# EAGLE design display (EAGLE 5.11)
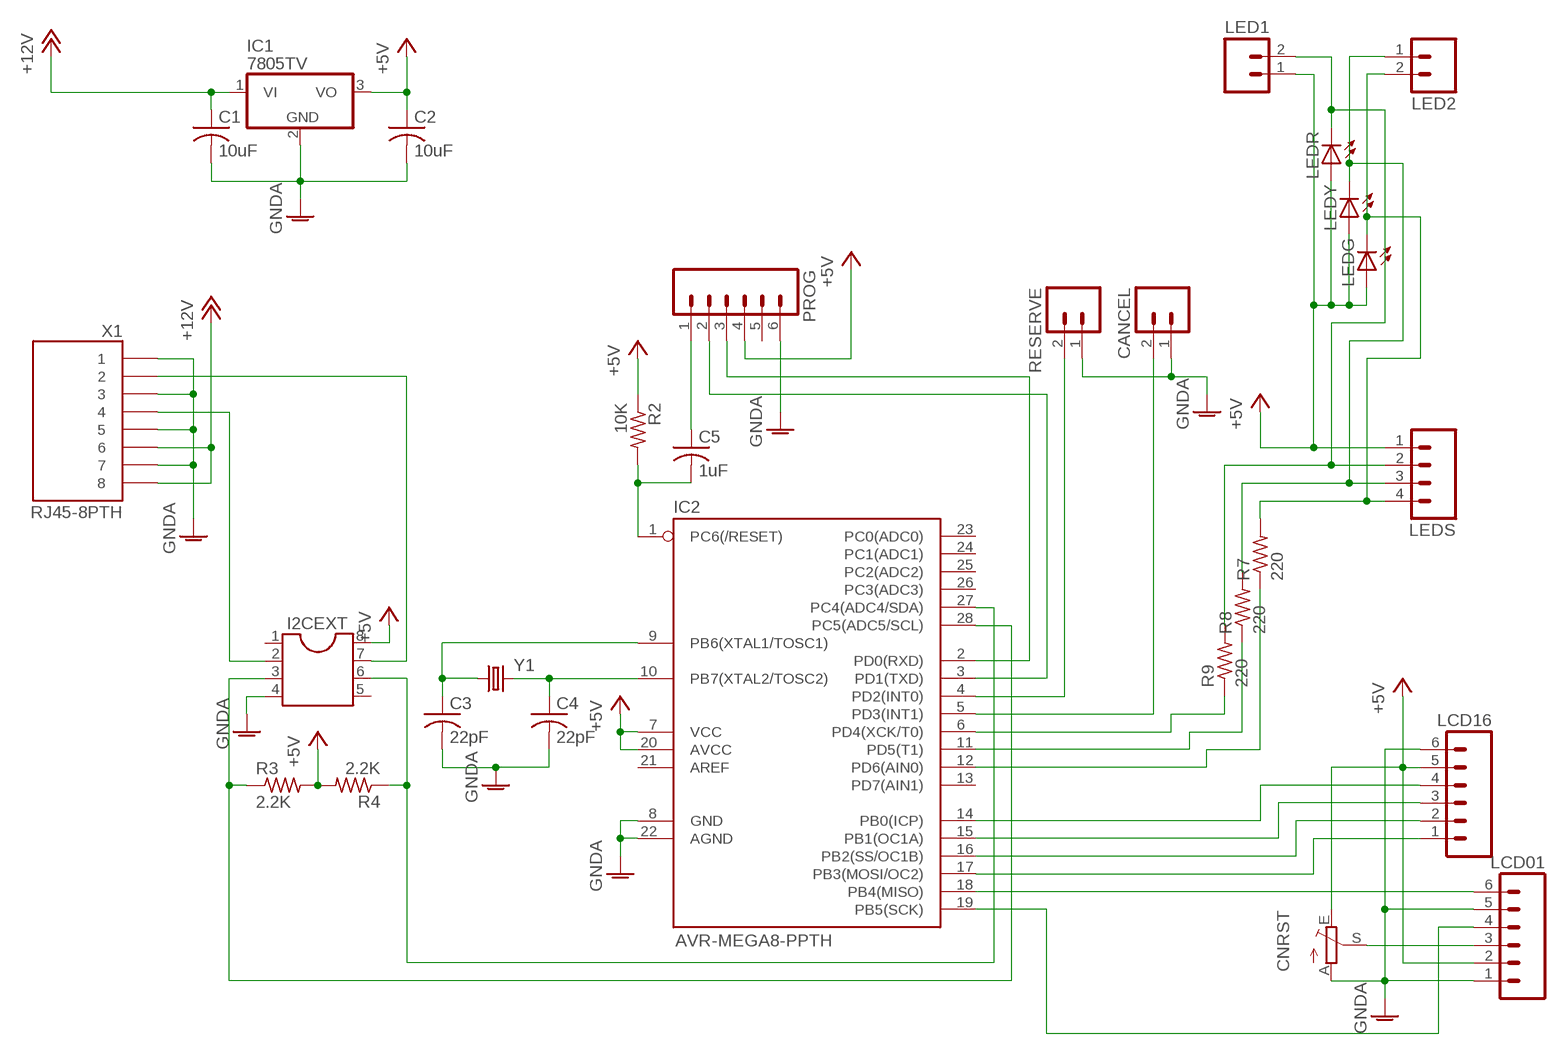
[diagram p0: schematic, sheet 1]

## Parts
C1  10uF  C-US025-024X044  [C025-024X044]
C2  10uF  C-US025-024X044  [C025-024X044]
C3  22pF  C-US025-024X044  [C025-024X044]
C4  22pF  C-US025-024X044  [C025-024X044]
C5  1uF  C-US025-024X044  [C025-024X044]
CANCEL  M02POLAR_LOCK  [MOLEX-1X2_LOCK]
CNRST  TRIM_EU-B25U  [B25U]
I2CEXT  DIL8  [DIL08]
IC1  7805TV  [TO220V]
IC2  AVR-MEGA8-PPTH  [DIL28-3]
LCD01  M06SIP_LOCK  [1X06-SIP_LOCK]
LCD16  M06SIP_LOCK  [1X06-SIP_LOCK]
LED1  M02LOCK  [1X02_LOCK]
LED2  M02LOCK  [1X02_LOCK]
LEDG  LED10MM  [LED10MM]
LEDR  LED10MM  [LED10MM]
LEDS  M04LOCK  [1X04_LOCK]
LEDY  LED10MM  [LED10MM]
PROG  M06LOCK  [1X06_LOCK]
R2  10K  R-US_0207/2V  [0207/2V]
R3  2.2K  R-US_0207/2V  [0207/2V]
R4  2.2K  R-US_0207/2V  [0207/2V]
R7  220  R-US_0207/2V  [0207/2V]
R8  220  R-US_0207/2V  [0207/2V]
R9  220  R-US_0207/2V  [0207/2V]
RESERVE  M02POLAR_LOCK  [MOLEX-1X2_LOCK]
X1  RJ45-8PTH  [RJ45-8]
Y1  CRYSTALHC49US  [HC49US]

## Nets
+5V: C2.1 CNRST.E I2CEXT.8 IC1.3(VO) IC2.7(VCC) IC2.20(AVCC) LCD01.2 LCD16.5 LED1.1 LEDG.A LEDR.A LEDS.1 LEDY.A PROG.4 R2.1 R3.2 R4.2
+12V: C1.1 IC1.1(VI) X1.6 X1.8
GNDA: C1.2 C2.2 C3.2 C4.2 CANCEL.1 CNRST.A I2CEXT.4 IC1.2(GND) IC2.8(GND) IC2.22(AGND) LCD01.1 LCD01.5 LCD16.6 PROG.6 RESERVE.1 X1.1 X1.3 X1.5 X1.7
LSDA: I2CEXT.2 X1.4
LSDC: I2CEXT.7 X1.2
N$1: C3.1 IC2.9(PB6(XTAL1/TOSC1)) Y1.1
N$2: C4.1 IC2.10(PB7(XTAL2/TOSC2)) Y1.2
N$3: I2CEXT.3 IC2.28(PC5(ADC5/SCL)) R3.1
N$4: C5.1 PROG.1
N$6: C5.2 IC2.1(PC6(/RESET)) R2.2
N$7: IC2.4(PD2(INT0)) RESERVE.2
N$8: CANCEL.2 IC2.5(PD3(INT1))
N$9: IC2.6(PD4(XCK/T0)) R9.1
N$10: I2CEXT.6 IC2.27(PC4(ADC4/SDA)) R4.1
N$11: IC2.11(PD5(T1)) R8.1
N$12: IC2.12(PD6(AIN0)) R7.1
N$13: LED1.2 LEDR.C LEDS.2 R9.2
N$14: IC2.19(PB5(SCK)) LCD01.4
N$17: CNRST.S LCD01.3
N$20: IC2.18(PB4(MISO)) LCD01.6
N$21: IC2.17(PB3(MOSI/OC2)) LCD16.1
N$22: IC2.3(PD1(TXD)) PROG.2
N$23: IC2.2(PD0(RXD)) PROG.3
N$24: IC2.16(PB2(SS/OC1B)) LCD16.2
N$25: IC2.15(PB1(OC1A)) LCD16.3
N$26: IC2.14(PB0(ICP)) LCD16.4
N$27: LED2.1 LEDS.3 LEDY.C R8.2
N$28: LED2.2 LEDG.C LEDS.4 R7.2
Unconnected: I2CEXT.1 I2CEXT.5 IC2.13(PD7(AIN1)) IC2.21(AREF) IC2.23(PC0(ADC0)) IC2.24(PC1(ADC1)) IC2.25(PC2(ADC2)) IC2.26(PC3(ADC3)) PROG.5

## Library data of the parts
C1-C5 = rcl:C-US: CAPACITOR, American symbol
CANCEL LED1 LED2 RESERVE = SparkFun:M02: Header 2 Standard 2-pin 0.1" header. Use with straight break away headers (SKU : PRT-00116), right angle break away headers (PRT-00553), swiss pins (PRT-00743), machine pins (PRT-00117), and female headers (PRT-00115). Molex polarized connector foot print use with SKU : PRT-08233 with associated crimp pins and housings.
CNRST = pot:TRIM_EU-: POTENTIOMETER
I2CEXT = ic-package:DIL8: Dual In Line / Socket
IC1 = linear:78*: Positive VOLTAGE REGULATOR Source: http://cache.national.com/ds/LM/LM78L05.pdf http://www.fairchildsemi.com/ds/LM/LM7805.pdf
IC2 = SparkFun:AVR-MEGA8-P: MICROCONTROLLER 8 Kbytes FLASH 1 kbytes SRAM 512 bytes EEPROM USART 4-channel 10 bit ADC 2-channel 8 bit ADC
LCD01 LCD16 PROG = SparkFun:M06: Header 6 Standard 6-pin 0.1" header. Use with straight break away headers (SKU : PRT-00116), right angle break away headers (PRT-00553), swiss pins (PRT-00743), machine pins (PRT-00117), and female headers (PRT-00115). Molex polarized connector foot print use with SKU : PRT-08094 with associated crimp pins and housings. NOTES ON THE VARIANTS LOCK and LOCK_LONGPADS... This footprint was designed to help hold the alignment of a through-hole component (i.e. 6-pin header) while soldering it into place. You may notice that each hole has been shifted either up or down by 0.005 of an inch from it's more standard position (which is a perfectly straight line). This slight alteration caused the pins (the squares in the middle) to touch the edges of the holes. Because they are alternating, it causes a "brace" to hold the component in place. 0.005 has proven to be the perfect amount of "off-center" position when using our standard breakaway headers. Although looks a little odd when you look at the bare footprint, once you have a header in there, the alteration is very hard to notice. Also, if you push a header all the way into place, it is covered up entirely on the bottom side. This idea of altering the position of holes to aid alignment will be further integrated into the Sparkfun Library for other footprints. It can help hold any component with 3 or more connection pins.
LEDG LEDR LEDY = SparkFun:LED: LEDs Standard schematic elements and footprints for 5mm, 3mm, 1206, and 0603 sized LEDs. 5mm - Spark Fun Electronics SKU : COM-00529 (and others)
LEDS = SparkFun:M04: Header 4 Standard 4-pin 0.1" header. Use with straight break away headers (SKU : PRT-00116), right angle break away headers (PRT-00553), swiss pins (PRT-00743), machine pins (PRT-00117), and female headers (PRT-00115). Molex polarized connector foot print use with SKU : PRT-08231 with associated crimp pins and housings. 1MM SMD Version SKU: PRT-10208
R2-R4 R7-R9 = resistor:R-US_: RESISTOR, American symbol
X1 = SparkFun:RJ45-8: RJ45 Jack Simple RJ45, 8-pin connection - connector for common Cat5, Cat5e, and Cat6 Ethernet cables. Footprint not yet proven in production. Connector sku is PRT-00643; Breakout PCB sku is BOB-00716.
Y1 = SparkFun:CRYSTAL: Crystals Various standard crystals. Proven footprints. Spark Fun Electronics SKU : COM-00534

## Board
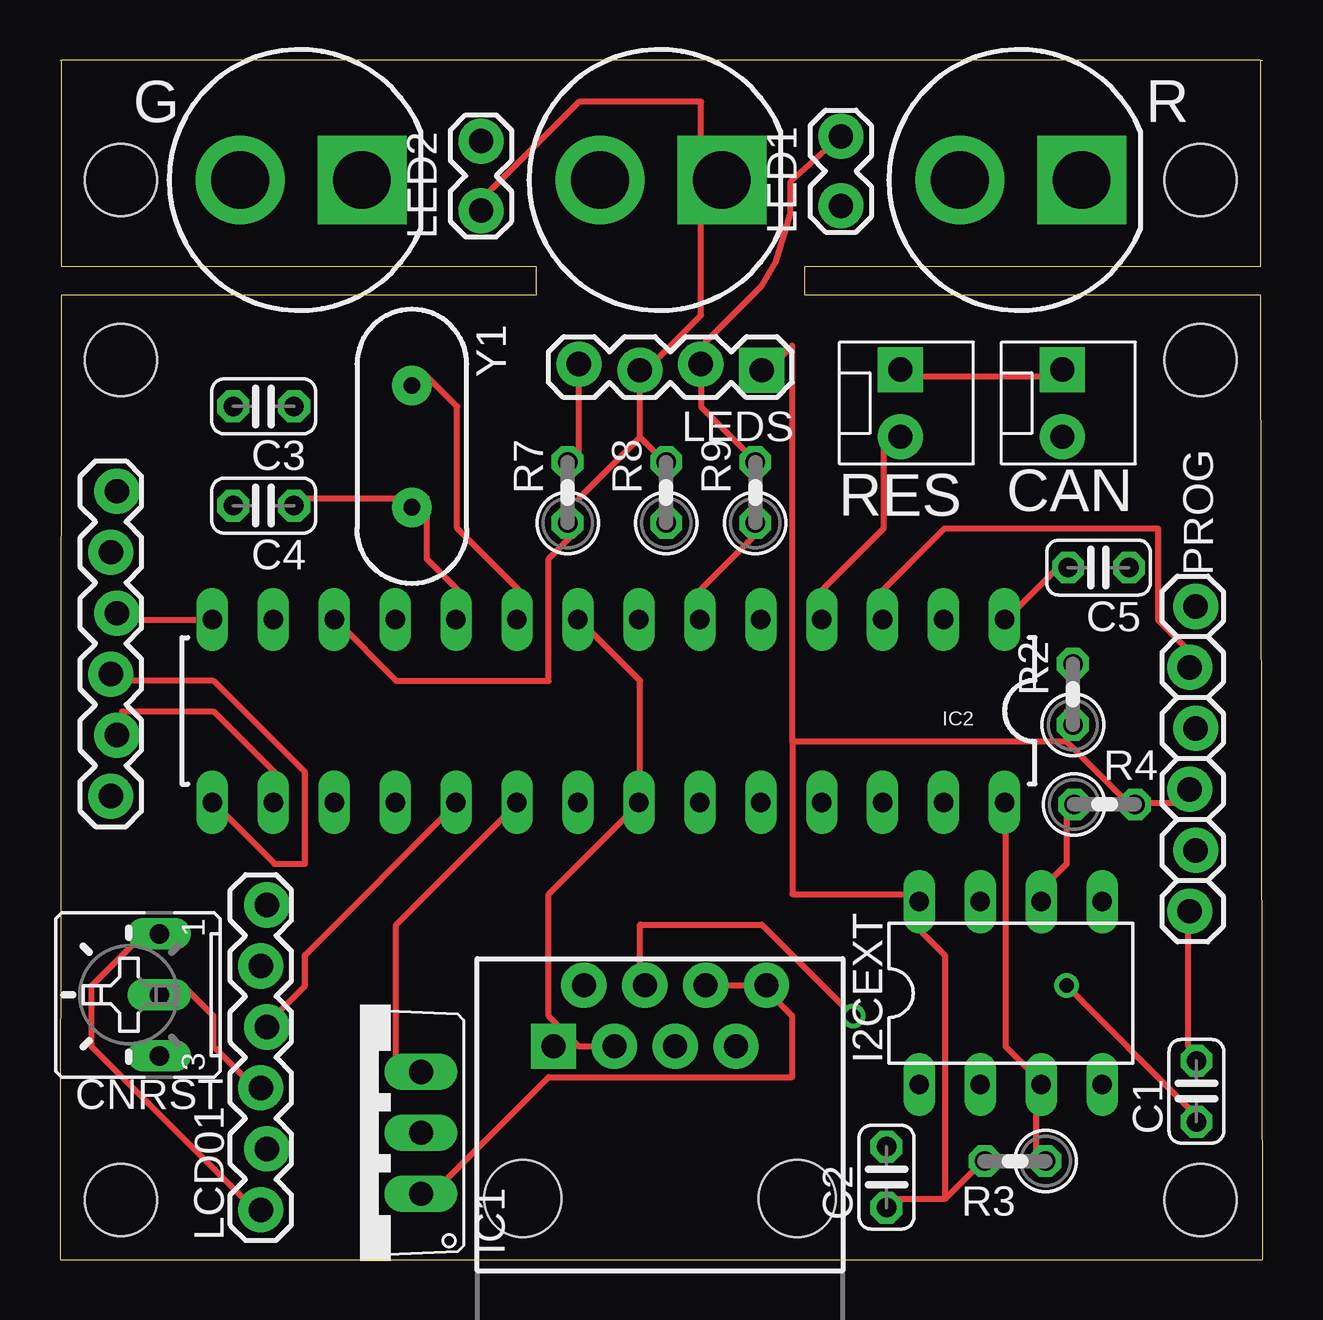
[diagram p1: board, top side]
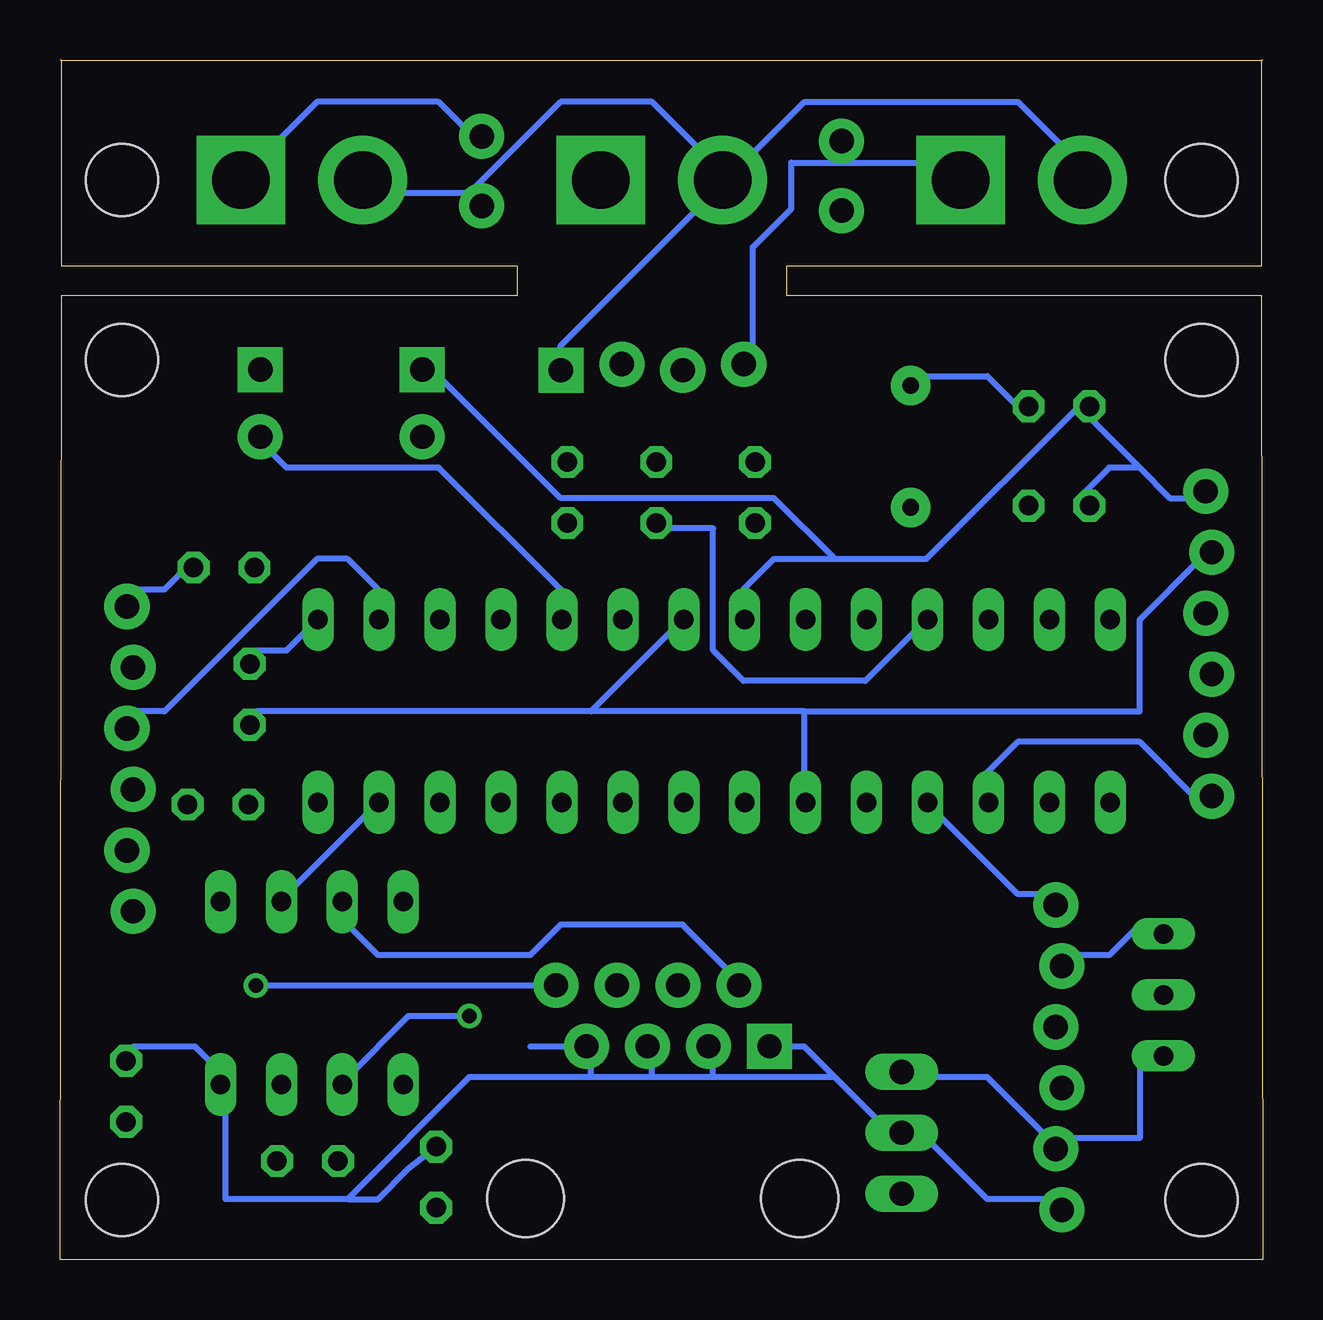
[diagram p2: board, bottom side, seen from below]

Size 50.13 x 49.98 mm. Coordinates in mm from the lower left corner, seen from the top.
Outline: 50.05,49.98 50.05,41.38 31.05,41.38 31.05,40.18 50.05,40.18 50.05,39.98 50.13,0 0,0 0.05,40.18 19.85,40.18 19.85,41.38 0.05,41.38 0.05,49.98
Outline: 50.05,49.98 50.13,49.98
Outline: 50.05,49.98 0.05,49.98
Outline: 0,49.98 0.05,49.98
Copper layers (1*16): Top 0.035mm / dielectric 1.5mm / Bottom 0.035mm
Design rules "default": minimum track width 10mil, minimum drill 24mil, track to track 8mil, track to pad 8mil, pad to pad 8mil, via to via 8mil, smd to smd 8mil, copper to edge 40mil, drill to drill 8mil, minimum pad ring 10mil, minimum via ring 8mil, stop-mask expansion 4mil, vias tented up to drill 0mil, thermal gap 10mil
Holes 3 mm at 2.55,2.48 47.55,2.48 47.55,37.48 2.55,37.48 47.55,44.98 2.55,44.98

### Footprints (pad centres in the part's own frame; a part is rotated, then mirrored left to right if it is on the bottom)
C025-024X044 = drill 0.813 octagon: 1 -1.27,0; 2 1.27,0
MOLEX-1X2_LOCK = drill 1.016 pad 1.88 square: 1 -0.127,0 | drill 1.016 pad 1.88 round: 2 2.667,0
B25U = drill 0.813 long: A 2.54,-0.889; E -2.54,-0.889; S 0,-0.889
DIL08 = drill 0.813 long: 1 -3.81,-3.81; 2 -1.27,-3.81; 3 1.27,-3.81; 4 3.81,-3.81; 5 3.81,3.81; 6 1.27,3.81; 7 -1.27,3.81; 8 -3.81,3.81
TO220V = drill 1.016 long: 1 -2.54,-2.54; 2 0,-2.54; 3 2.54,-2.54
DIL28-3 = drill 0.813 long: 1 -16.51,-3.81; 2 -13.97,-3.81; 3 -11.43,-3.81; 4 -8.89,-3.81; 5 -6.35,-3.81; 6 -3.81,-3.81; 7 -1.27,-3.81; 8 1.27,-3.81; 9 3.81,-3.81; 10 6.35,-3.81; 11 8.89,-3.81; 12 11.43,-3.81; 13 13.97,-3.81; 14 16.51,-3.81; 15 16.51,3.81; 16 13.97,3.81; 17 11.43,3.81; 18 8.89,3.81; 19 6.35,3.81; 20 3.81,3.81; 21 1.27,3.81; 22 -1.27,3.81; 23 -3.81,3.81; 24 -6.35,3.81; 25 -8.89,3.81; 26 -11.43,3.81; 27 -13.97,3.81; 28 -16.51,3.81
1X06-SIP_LOCK = drill 1.016 pad 1.88 round: 1 0,0; 2 2.54,-0.254; 3 5.08,0; 4 7.62,-0.254; 5 10.16,0; 6 12.7,-0.254
1X02_LOCK = drill 1.016 pad 1.88 round: 1 -0.178,0; 2 2.718,0
LED10MM = drill 2.4 pad 3.7 round: A 2.54,0 | drill 2.4 pad 3.7 square: C -2.54,0
1X04_LOCK = drill 1.016 pad 1.88 square: 1 0,0.127 | drill 1.016 pad 1.88 round: 2 2.54,-0.127; 3 5.08,0.127; 4 7.62,-0.127
1X06_LOCK = drill 1.016 pad 1.88 round: 1 0,0; 2 2.54,-0.254; 3 5.08,0; 4 7.62,-0.254; 5 10.16,0; 6 12.7,-0.254
0207/2V = drill 0.813 octagon: 1 -1.27,0; 2 1.27,0
RJ45-8 = drill 1 pad 1.88 square: 1 -4.445,6.35 | drill 1 pad 1.88 round: 2 -3.175,8.89; 3 -1.905,6.35; 4 -0.635,8.89; 5 0.635,6.35; 6 1.905,8.89; 7 3.175,6.35; 8 4.445,8.89 | hole 3.2: -5.715,0; 5.715,0
HC49US = drill 0.7 pad 1.651 round: 1 -2.54,0; 2 2.54,0

### Placement (x,y rotation side)
C1  47.37,7.01 90 top
C2  34.45,3.43 90 top
C3  8.49,35.55 180 top
C4  8.49,31.41 180 top
C5  43.29,28.83 180 top
CANCEL  41.78,36.95 270 top
CNRST  3.25,11.03 90 top
I2CEXT  39.63,11.1 0 top
IC1  12.51,5.28 90 top
IC2  22.86,22.86 180 top
LCD01  8.37,2.07 90 top
LCD16  2.12,19.31 90 top
LED1  32.55,44.08 90 top
LED2  17.55,43.88 90 top
LEDG  10.05,44.98 180 top
LEDR  40.05,44.98 180 top
LEDS  29.25,37.18 180 top
LEDY  25.05,44.98 180 top
PROG  47.34,27.21 270 top
R2  42.22,23.55 90 top
R3  39.81,4.1 180 top
R4  43.54,18.96 0 top
R7  21.16,31.96 90 top
R8  25.27,31.96 90 top
R9  28.98,31.96 90 top
RESERVE  35.03,36.95 270 top
X1  25.01,2.54 0 top
Y1  14.67,33.88 270 top

### Tracks (layer width: path | path; a pad name or v marks a point on that pad's centre or on a via)
+5V
  Top 0.254: IC1.3 14.02,7.6 14.02,13.95 19.1,19.03 IC2.20 | 44.5,19.03 47.04,19.03 PROG.4 | 41.96,21.57 44.5,19.03 | 41.96,21.57 41.96,22.84 R2.1 | 44.5,19.03 R4.2 | 36.88,2.52 38.15,3.79 R3.2 | 36.88,2.52 36.88,12.68 35.61,13.95 I2CEXT.8 35.61,15.22 30.53,15.22 30.53,21.57 | LEDS.1 29.26,36.81 30.53,38.08 30.53,21.57 | 41.96,21.57 30.53,21.57 | 36.88,2.52 34.34,2.52 C2.1
  Bottom 0.254: 8.94,5.06 5.13,5.06 5.13,8.87 CNRST.E | 8.94,5.06 11.48,7.6 14.02,7.6 IC1.3 | 8.94,5.06 LCD01.2 | 27.99,22.84 24.18,26.65 IC2.7 | 27.99,22.84 41.96,22.84 R2.1 | 19.1,22.84 27.99,22.84 | 19.1,22.84 5.13,22.84 5.13,26.65 2.59,29.19 LCD16.5 | 19.1,22.84 19.1,20.3 IC2.20 | LEDG.A 7.67,45.7 10.21,48.24 19.1,48.24 21.64,45.7 LEDY.A | 33.07,44.43 36.88,44.43 LEDR.A | 33.07,44.43 29.26,48.24 25.45,48.24 22.91,45.7 LEDY.A | 33.07,44.43 LED1.1 | LEDY.A 22.91,44.43 29.26,38.08 29.26,36.81 LEDS.1
+12V  (via drill 0.61)
  Top 0.254: v41.96,11.41 47.04,6.33 C1.1 | 29.26,11.41 30.53,10.14 30.53,7.6 20.37,7.6 15.29,2.52 IC1.1 | 29.26,11.41 26.72,11.41 X1.6 | 29.26,11.41 X1.8
  Bottom 0.254: v41.96,11.41 29.26,11.41 X1.8
GNDA
  Top 0.254: PROG.6 47.04,13.95 47.04,8.87 C1.2 | RESERVE.1 35.61,36.81 41.96,36.81 CANCEL.1 | IC2.8 21.64,26.65 24.18,24.11 24.18,20.3 IC2.22 24.18,19.03 20.37,15.22 20.37,10.14 21.64,8.87 22.91,8.87 X1.3 | LCD01.1 7.67,2.52 1.32,8.87 1.32,11.41 3.86,13.95 CNRST.A
  Bottom 0.254: C1.2 47.04,8.87 44.5,8.87 43.23,7.6 I2CEXT.4 43.23,6.33 43.23,2.52 38.15,2.52 | 27.99,8.87 30.53,8.87 | 38.15,2.52 36.88,2.52 35.61,3.79 C2.2 | LCD01.1 8.94,2.52 11.48,2.52 14.02,5.06 IC1.2 15.29,5.06 17.83,7.6 | CNRST.A 5.13,13.95 6.4,12.68 7.67,12.68 LCD01.5 | 17.83,7.6 19.1,8.87 20.37,8.87 X1.1 | 17.83,7.6 22.91,7.6 | 22.91,7.6 25.45,7.6 | 25.45,7.6 27.99,7.6 | 7.67,35.54 5.13,33 | 5.13,33 3.86,31.73 2.59,31.73 LCD16.6 | 7.67,35.54 14.02,29.19 17.83,29.19 | 17.83,29.19 20.37,29.19 21.64,27.92 IC2.8 | 7.67,35.54 C3.2 | 17.83,29.19 20.37,31.73 29.26,31.73 34.34,36.81 RESERVE.1 | 5.13,33 6.4,33 7.67,31.73 C4.2 | 22.91,7.6 22.91,8.87 X1.3 | 25.45,7.6 25.45,8.87 X1.5 | 38.15,2.52 33.07,7.6 27.99,7.6 | 27.99,7.6 27.99,8.87 | 27.99,8.87 X1.7
LSDA  (via drill 0.61)
  Top 0.254: v33.07,10.14 29.26,13.95 24.18,13.95 24.18,11.41 X1.4
  Bottom 0.254: v33.07,10.14 35.61,10.14 38.15,7.6 I2CEXT.2
LSDC
  Bottom 0.254: I2CEXT.7 38.15,13.95 36.88,12.68 30.53,12.68 29.26,13.95 24.18,13.95 21.64,11.41 X1.2
N$1
  Top 0.254: IC2.9 19.1,27.92 16.56,30.46 16.56,35.54 15.29,36.81 Y1.1
  Bottom 0.254: C3.1 10.21,35.54 11.48,36.81 14.02,36.81 Y1.1
N$2
  Top 0.254: IC2.10 16.56,27.92 15.29,29.19 15.29,31.73 Y1.2 14.02,31.73 10.21,31.73 C4.1
N$3
  Top 0.254: R3.1 40.69,3.79 40.69,6.33 I2CEXT.3 40.69,7.6 39.42,8.87 39.42,19.03 IC2.28
N$4
  Bottom 0.254: C5.1 44.5,29.19 45.77,27.92 47.04,27.92 PROG.1
N$6
  Top 0.254: C5.2 41.96,29.19 39.42,26.65 IC2.1
  Bottom 0.254: IC2.1 39.42,26.65 40.69,25.38 41.96,25.38 R2.2
N$7
  Top 0.254: IC2.4 31.8,27.92 34.34,30.46 34.34,34.27 RESERVE.2
N$8
  Bottom 0.254: IC2.5 29.26,27.92 34.34,33 40.69,33 41.96,34.27 CANCEL.2
N$9
  Top 0.254: IC2.6 26.72,27.92 29.26,30.46 R9.1
N$10
  Top 0.254: I2CEXT.6 40.69,15.22 41.96,16.49 41.96,19.03 R4.1
  Bottom 0.254: IC2.27 36.88,19.03 40.69,15.22 I2CEXT.6
N$11
  Bottom 0.254: IC2.11 14.02,26.65 16.56,24.11 21.64,24.11 22.91,25.38 22.91,30.46 25.45,30.46 R8.1
N$12
  Top 0.254: IC2.12 11.48,26.65 14.02,24.11 20.37,24.11 20.37,29.19 21.64,30.46 R7.1
N$13
  Top 0.254: R9.2 29.26,33 26.72,35.54 26.72,36.81 LEDS.2 | 33.07,46.97 LED1.2 30.45,44.9 30.45,43.58 29.85,41.58 29.25,40.58 26.71,38.04
  Top 0.406: LEDS.2 26.71,38.04
  Bottom 0.254: LED1.2 33.07,46.97 34.34,48.24 39.42,48.24 41.96,45.7 LEDR.C | R9.2 29.26,33
N$14
  Top 0.254: IC2.19 16.56,19.03 10.21,12.68 10.21,11.41 8.94,10.14 LCD01.4
N$17
  Top 0.254: CNRST.S 5.13,11.41 6.4,10.14 6.4,8.87 7.67,7.6 LCD01.3
N$20
  Bottom 0.254: IC2.18 14.02,19.03 10.21,15.22 8.94,15.22 LCD01.6
N$21
  Bottom 0.254: IC2.17 11.48,20.3 10.21,21.57 5.13,21.57 2.59,19.03 LCD16.1
N$22
  Top 0.254: IC2.3 34.34,27.92 36.88,30.46 45.77,30.46 45.77,26.65 47.04,25.38 PROG.2
N$23
  Bottom 0.254: IC2.2 36.88,27.92 38.15,29.19 39.42,29.19 45.77,22.84 47.04,22.84 PROG.3
N$24
  Top 0.254: IC2.16 8.94,20.3 6.4,22.84 2.59,22.84 2.59,21.57 LCD16.2
N$25
  Top 0.254: IC2.15 6.4,19.03 8.94,16.49 10.21,16.49 10.21,20.3 6.4,24.11 2.59,24.11 LCD16.3
N$26
  Top 0.254: IC2.14 6.4,26.65 2.59,26.65 LCD16.4
N$27
  Top 0.254: 24.18,34.27 25.45,33 R8.2 | 24.18,34.27 24.18,36.81 | 21.64,31.73 24.18,34.27 | LED2.1 17.83,44.43 21.64,48.24 26.72,48.24 26.72,45.7 LEDY.C 26.72,44.43 26.72,39.35 24.18,36.81 | 24.18,36.81 LEDS.3
N$28
  Top 0.254: R7.2 21.64,33 21.64,36.81 LEDS.4
  Bottom 0.254: 17.83,45.7 12.75,45.7 LEDG.C | 17.83,45.7 LED2.2 | 17.83,45.7 19.65,45.7 19.65,43.78 21.25,42.18 21.25,37.69
  Bottom 0.406: LEDS.4 21.25,37.69

### Text on the board
_tsilk: G | R | RES | CAN